# EAGLE design Motor Speed Controller (EAGLE 9.6.2)
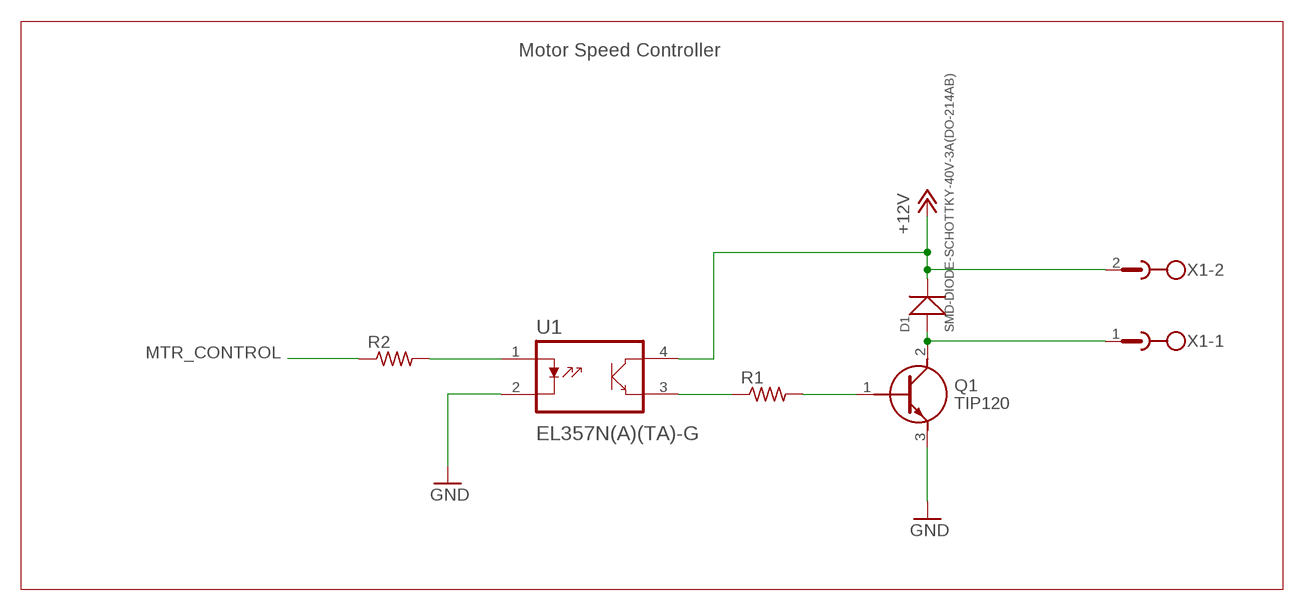
[diagram p0: schematic, sheet 1]

## Parts
D1  SMD-DIODE-SCHOTTKY-40V-3A(DO-214AB)  [DO-214AB]
Q1  TIP120  [TO220]
R1  R-US_R0805  [R0805]
R2  R-US_R0805  [R0805]
U1  EL357N(A)(TA)-G  [SOP254P700X200-4N]
X1  MSTBA4  [MSTBA4]

## Nets
+12V: D1.2(-) U1.4(C) X1.2
GND: Q1.3(E) U1.2(K)
MTR_CONTROL: R2.1
N$1: R2.2 U1.1(A)
N$2: R1.1 U1.3(E)
N$3: Q1.1(B) R1.2
N$4: D1.1(+) Q1.2(C) X1.1
Unconnected: X1.3 X1.4

## Notes on the sheet
- Motor Speed Controller

## Library data of the parts
D1 = PC_Diode_SS34:SMD-DIODE-SCHOTTKY-40V-3A(DO-214AB): 304020018; AVAILABILITY: Unavailable; DESCRIPTION: Rectifier, Schottky; DO-214AB; 3.0A IF; 0.75V; 40V; 100A IFRM; 10000V/us; 1000pF; MF: Vishay; MP: SS34-E3/57T; PACKAGE: DO-214 Vishay; PRICE: None
Q1 = PC_Transistor_TIP120:TIP120: NPN Darlington Transistor Source: Datasheet <https://www.fairchildsemi.com/datasheets/TI/TIP120.pdf>; DESCRIPTION: NPN Darlington Transistor; HEIGHT: mm; MANUFACTURER_NAME: Fairchild Semiconductor; MANUFACTURER_PART_NUMBER: TIP120; MOUSER_PART_NUMBER: 512-TIP120; MOUSER_PRICE-STOCK: https://www.mouser.com/Search/Refine.aspx?Keyword=512-TIP120
R1 R2 = rcl:R-US_: RESISTOR, American symbol; SPICEPREFIX: R
U1 = PC_Optocoupler_EL357:EL357N(A)(TA)-G: Optocoupler [Everlight Electronics] EL357N(A)(TA)-G Optocoupler; AVAILABILITY: Unavailable; DESCRIPTION: Optocoupler [Everlight Electronics] EL357N_A__TA_-G Optocoupler; MF: Everlight; MP: EL357N_A__TA_-G; PACKAGE: SOP-4 Everlight; PRICE: None
X1 = con-phoenix-508:MSTBA4: PHOENIX; MF: FARNELL; MPN: 1757268; OC_FARNELL: 3705195; OC_NEWARK: 71C4163

## Board
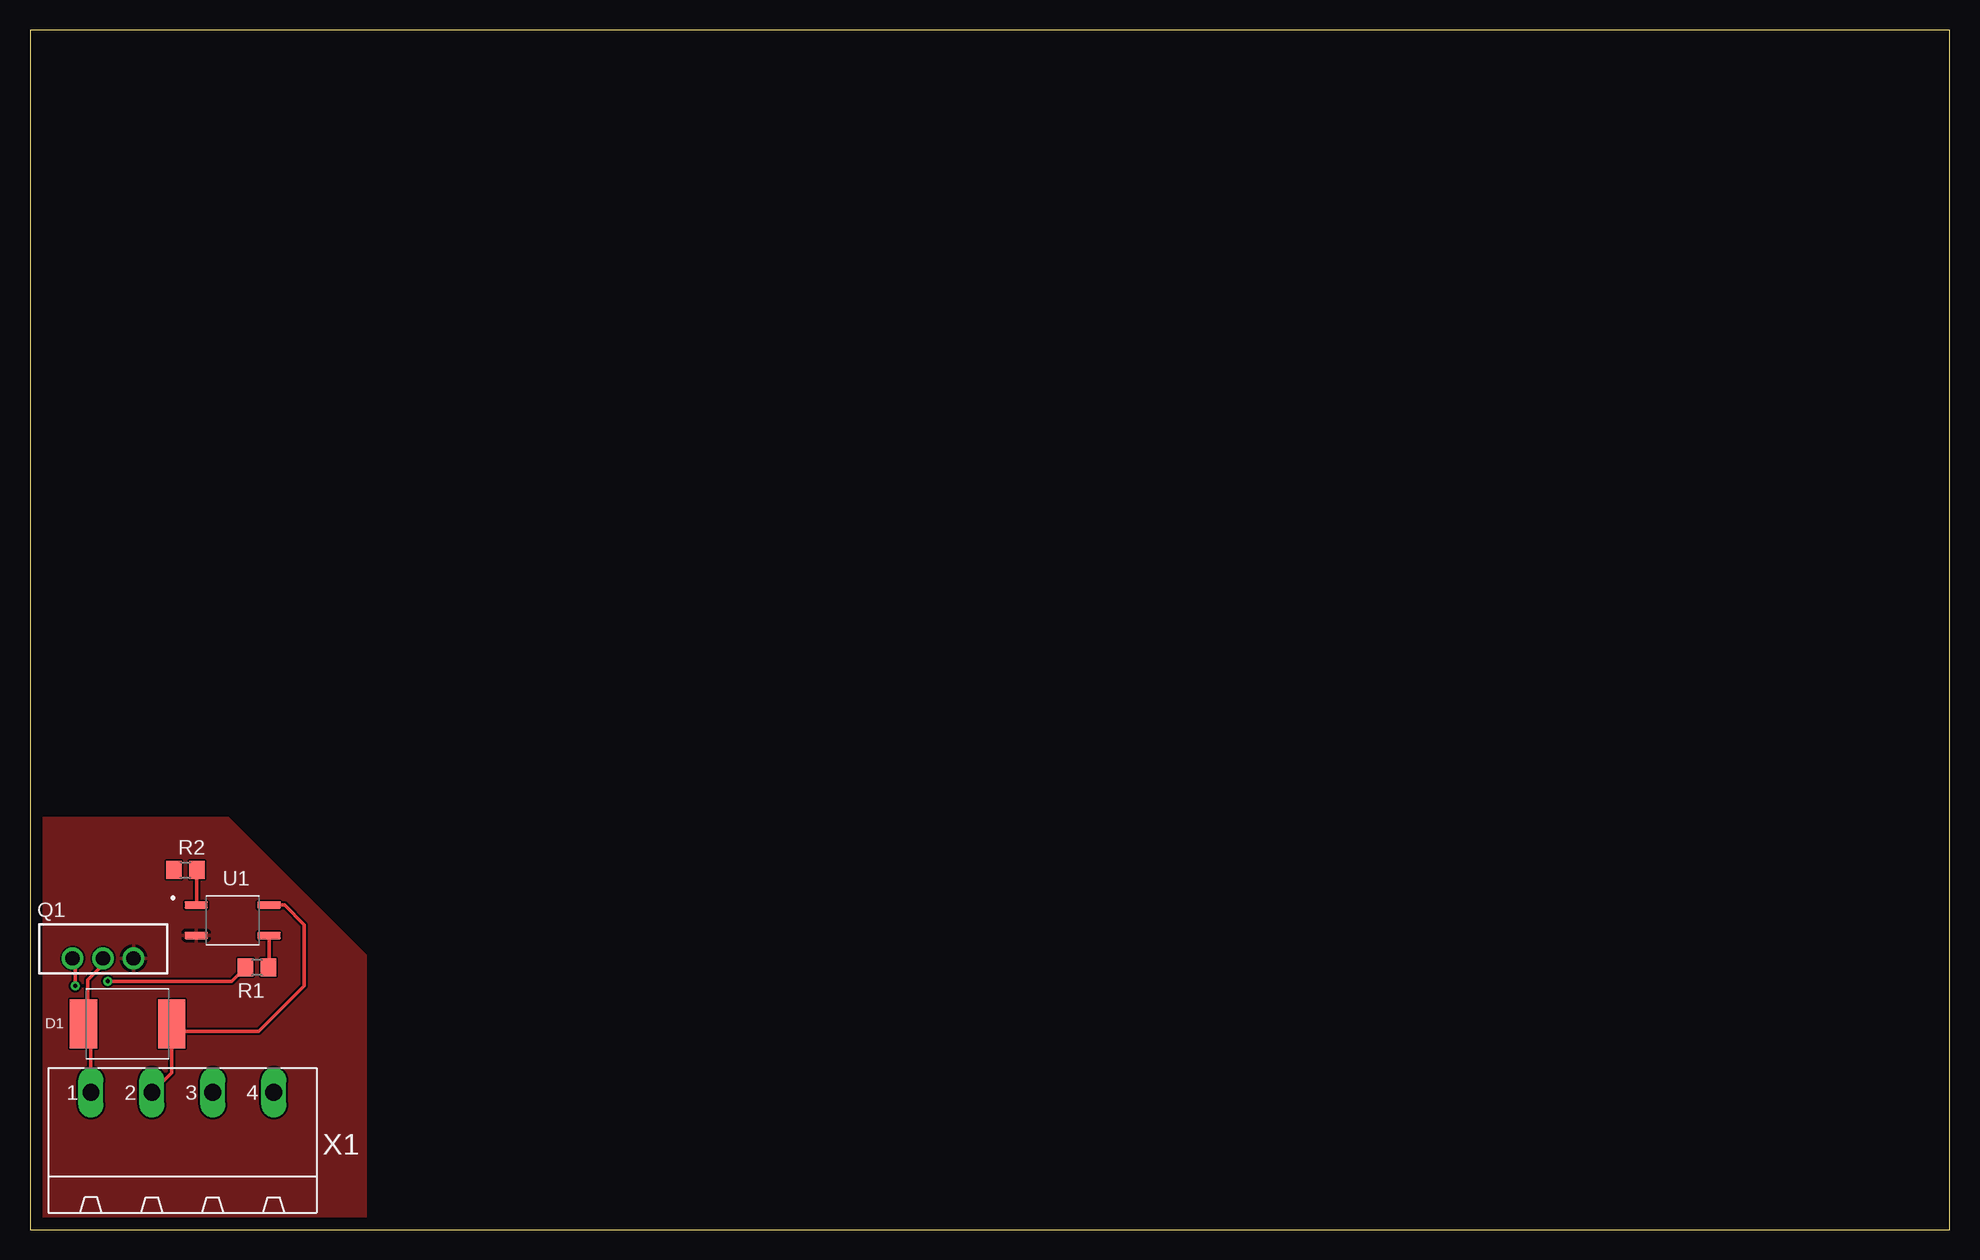
[diagram p1: board, top side]
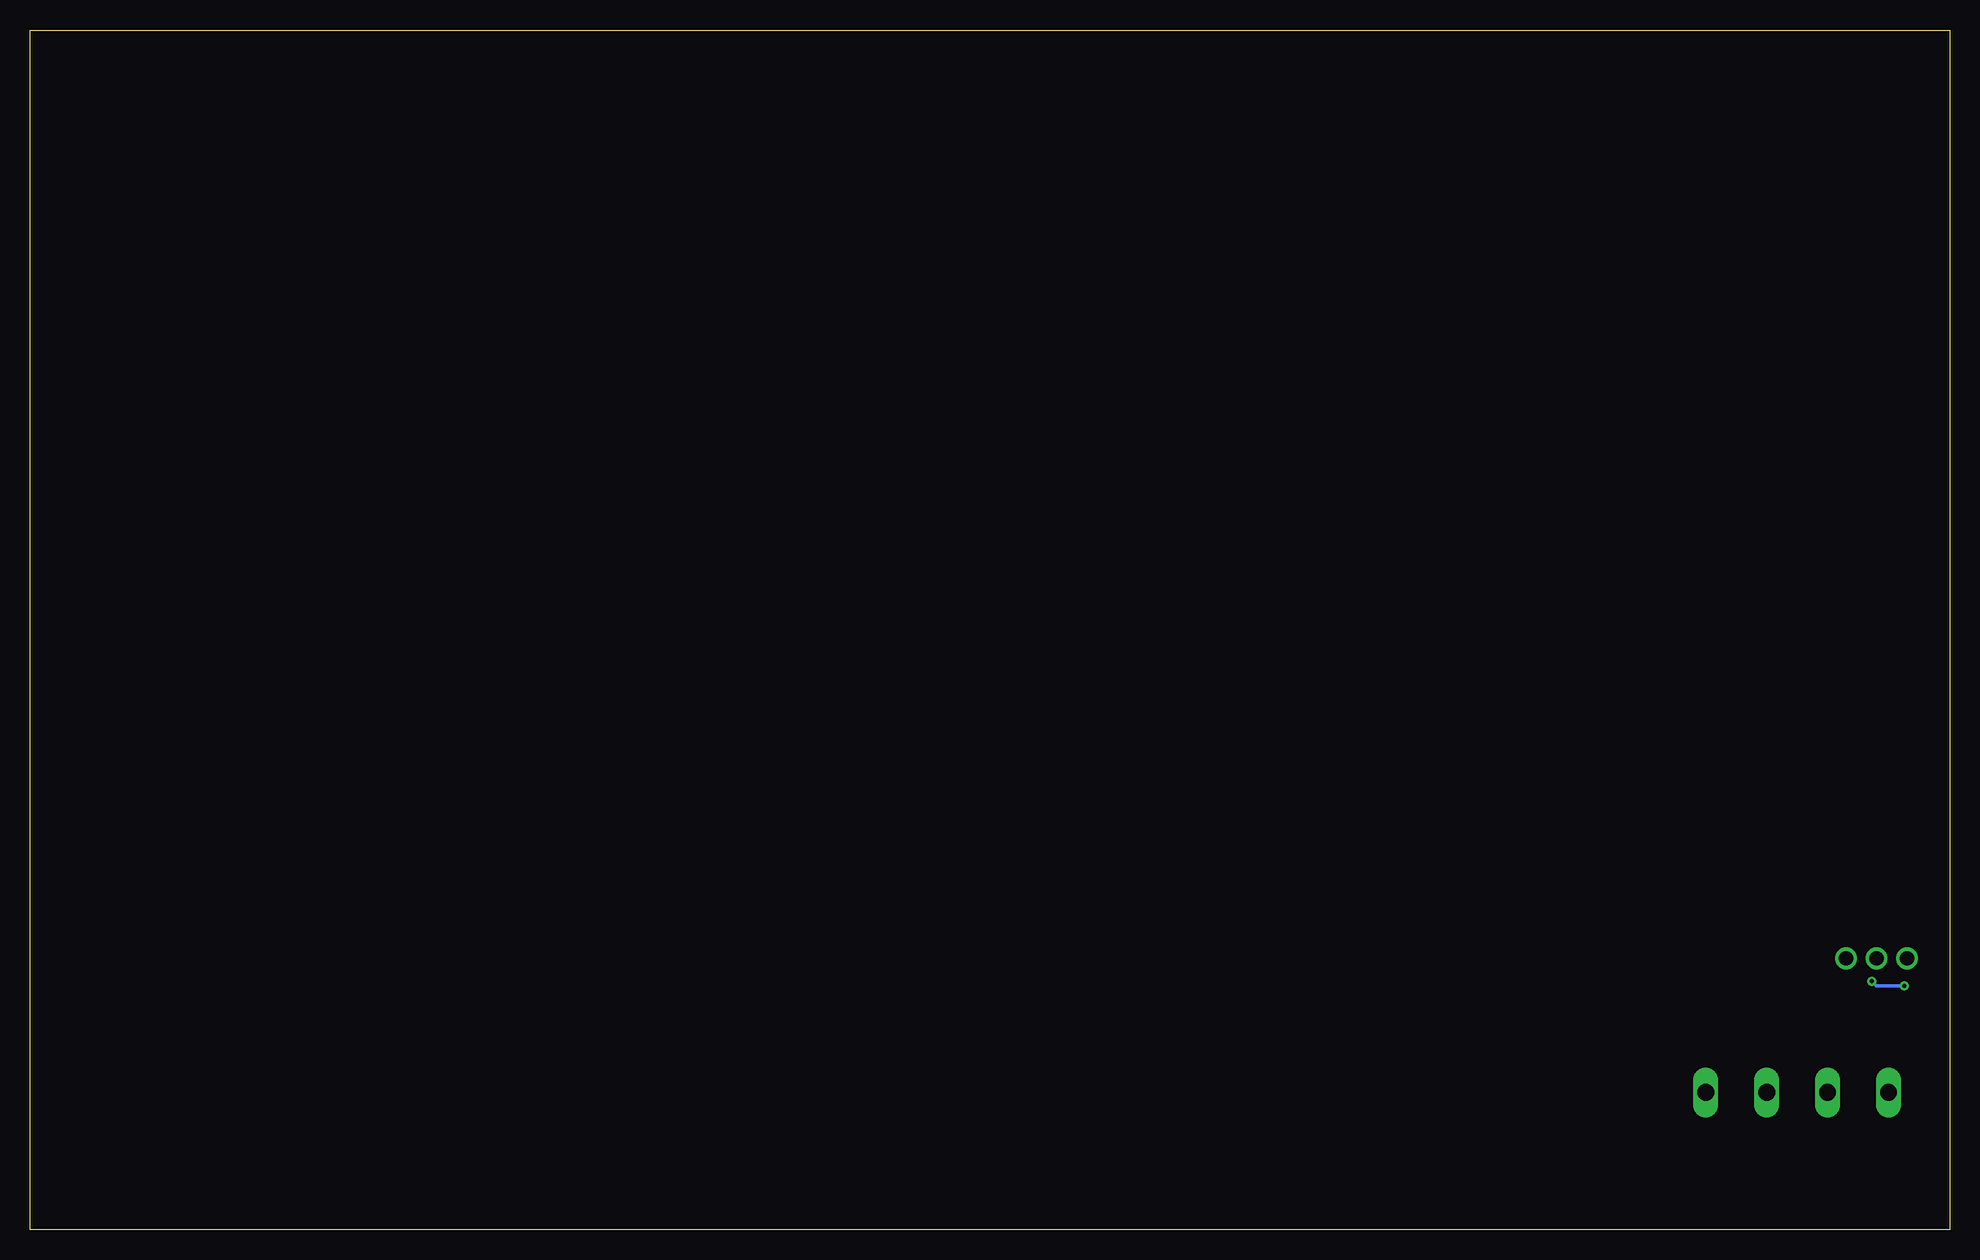
[diagram p2: board, bottom side, seen from below]

Size 160 x 100 mm. Coordinates in mm from the lower left corner, seen from the top.
Outline: 0,0 160,0 160,100 0,100 0,0
Copper layers (1*16): Top 0.035mm / dielectric 1.5mm / Bottom 0.035mm
Design rules "default": minimum track width 6mil, minimum drill 0.35mm, track to track 6mil, track to pad 6mil, pad to pad 6mil, via to via 6mil, smd to smd 6mil, copper to edge 40mil, drill to drill 6mil, minimum pad ring 10mil, minimum via ring 8mil, stop-mask expansion 4mil, vias tented up to drill 0mil, thermal gap 10mil

### Footprints (pad centres in the part's own frame; a part is rotated, then mirrored left to right if it is on the bottom)
DO-214AB = smd 2.286 x 4.064: 1 -3.683,0; 2 3.683,0
TO220 = drill 1.2 pad 1.8: 1 -2.54,0; 2 0,0; 3 2.54,0
R0805 = smd 1.3 x 1.5: 1 -0.95,0; 2 0.95,0
SOP254P700X200-4N = smd 1.93 x 0.59: 1 -3.04,1.27; 2 -3.04,-1.27; 3 3.04,-1.27; 4 3.04,1.27
MSTBA4 = drill 1.397 long: 1 -7.62,5.08; 2 -2.54,5.08; 3 2.54,5.08; 4 7.62,5.08

### Placement (x,y rotation side)
D1  8.13,17.14 0 top
Q1  6.1,22.61 0 top
R1  18.92,21.84 180 top
R2  12.95,29.97 0 top
U1  16.89,25.78 0 top
X1  12.7,6.35 0 top

### Tracks (layer width: path | path; a pad name or v marks a point on that pad's centre or on a via)
+12V
  Top 0.305: D1.2 11.81,16.51 | 11.81,16.51 11.81,13.08 X1.2 | U1.4 21.21,27.05 22.86,25.4 22.86,20.32 19.05,16.51 11.81,16.51
GND
  pour Top: 1.27,34.29 16.51,34.29 27.94,22.86 27.94,0 0,0 0,34.29
N$1
  Top 0.305: R2.2 13.9,27.1 U1.1
N$2
  Top 0.305: U1.3 19.93,21.9 R1.1
N$3  (via drill 0.35)
  Top 0.305: R1.2 16.83,20.7 v6.48,20.7 | v3.76,20.32 3.76,22.4 Q1.1
  Bottom 0.305: v6.48,20.7 6.1,20.32 v3.76,20.32
N$4
  Top 0.305: X1.1 5.08,16.51 D1.1 4.83,17.53 4.83,20.83 6.1,22.1 Q1.2